# EAGLE design Keypad_06 (EAGLE 6.5.0)
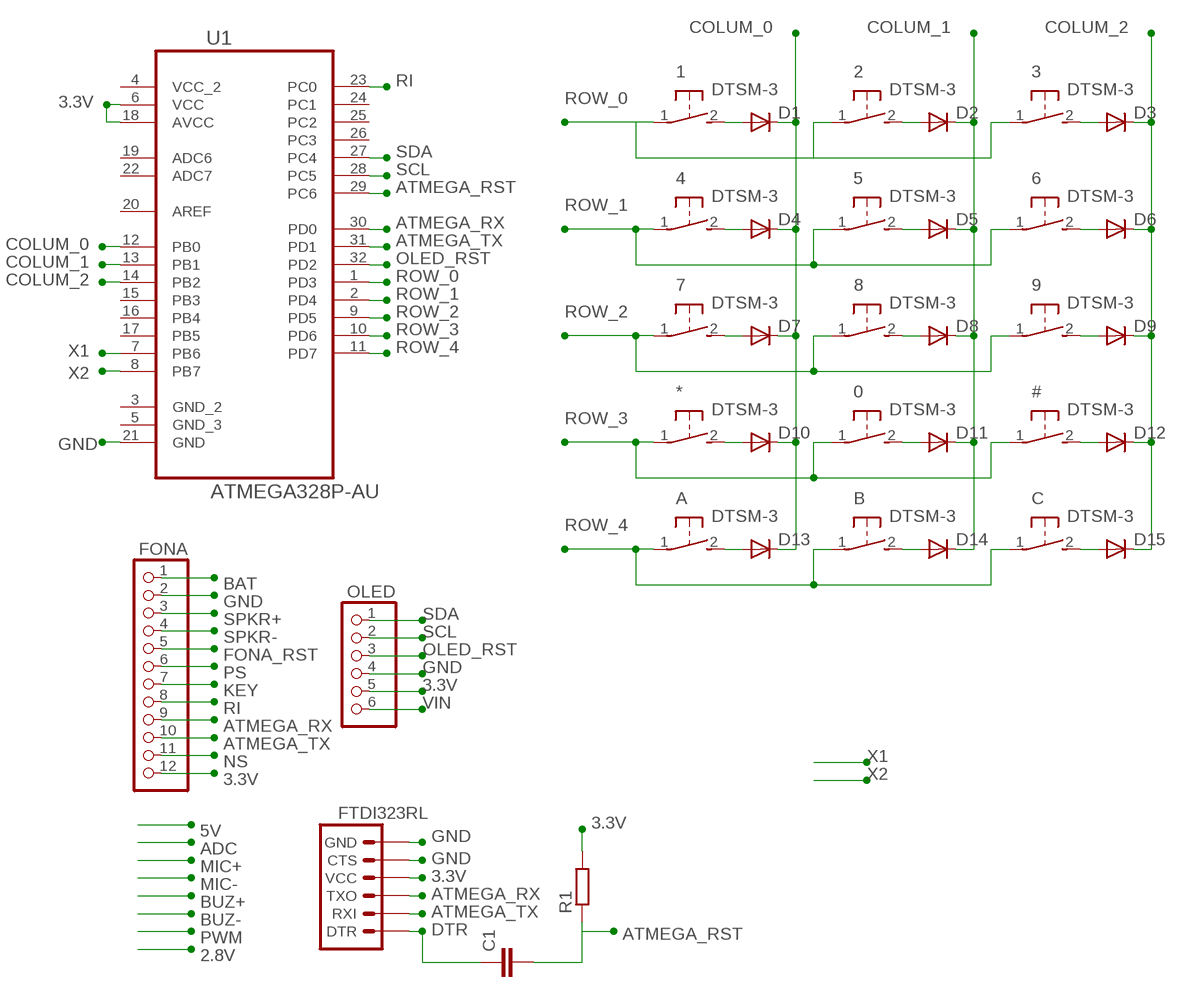
[diagram p0: schematic, sheet 1]

## Parts
0  DTSM-3  [DTSM-3]
1  DTSM-3  [DTSM-3]
2  DTSM-3  [DTSM-3]
3  DTSM-3  [DTSM-3]
4  DTSM-3  [DTSM-3]
5  DTSM-3  [DTSM-3]
6  DTSM-3  [DTSM-3]
7  DTSM-3  [DTSM-3]
8  DTSM-3  [DTSM-3]
9  DTSM-3  [DTSM-3]
#  DTSM-3  [DTSM-3]
*  DTSM-3  [DTSM-3]
A  DTSM-3  [DTSM-3]
B  DTSM-3  [DTSM-3]
C  DTSM-3  [DTSM-3]
C1  C-EUC0805  [C0805]
D1  DIODE-SOD123  [SOD123]
D2  DIODE-SOD123  [SOD123]
D3  DIODE-SOD123  [SOD123]
D4  DIODE-SOD123  [SOD123]
D5  DIODE-SOD123  [SOD123]
D6  DIODE-SOD123  [SOD123]
D7  DIODE-SOD123  [SOD123]
D8  DIODE-SOD123  [SOD123]
D9  DIODE-SOD123  [SOD123]
D10  DIODE-SOD123  [SOD123]
D11  DIODE-SOD123  [SOD123]
D12  DIODE-SOD123  [SOD123]
D13  DIODE-SOD123  [SOD123]
D14  DIODE-SOD123  [SOD123]
D15  DIODE-SOD123  [SOD123]
FONA  PINHD-1X12  [1X12]
FTDI323RL  ARDUINO_SERIAL_PROGRAMLOCK  [1X06_LOCK]
OLED  PINHD-1X6  [1X06]
R1  R-EU_M1206  [M1206]
U1  ATMEGA328P-AU  [QFP80P900X900X120-32N]

## Nets
1: #.2 D12.A
3: 3.2 D3.A
3.3V: FONA.12 FTDI323RL.4(VCC) OLED.5 R1.2 U1.6(VCC) U1.18(AVCC)
5: 5.2 D5.A
ATMEGA_RST: C1.2 R1.1 U1.29(PC6)
ATMEGA_RX: FONA.9 FTDI323RL.3(TXO) U1.30(PD0)
ATMEGA_TX: FONA.10 FTDI323RL.2(RXI) U1.31(PD1)
BAT: FONA.1
COLUM_0: D1.C D4.C D7.C D10.C D13.C U1.12(PB0)
COLUM_1: D2.C D5.C D8.C D11.C D14.C U1.13(PB1)
COLUM_2: D3.C D6.C D9.C D12.C D15.C U1.14(PB2)
DTR: C1.1 FTDI323RL.1(DTR)
FONA_RST: FONA.5
GND: FONA.2 FTDI323RL.5(CTS) FTDI323RL.6(GND) OLED.4 U1.21(GND)
KEY: FONA.7
N$6: 1.2 D1.A
N$7: 2.2 D2.A
N$14: 4.2 D4.A
N$16: 6.2 D6.A
N$19: 7.2 D7.A
N$20: 8.2 D8.A
N$21: 9.2 D9.A
N$24: *.2 D10.A
N$25: 0.2 D11.A
N$32: A.2 D13.A
N$33: B.2 D14.A
N$34: C.2 D15.A
NS: FONA.11
OLED_RST: OLED.3 U1.32(PD2)
PS: FONA.6
RI: FONA.8 U1.23(PC0)
ROW_0: 1.1 2.1 3.1 U1.1(PD3)
ROW_1: 4.1 5.1 6.1 U1.2(PD4)
ROW_2: 7.1 8.1 9.1 U1.9(PD5)
ROW_3: 0.1 #.1 *.1 U1.10(PD6)
ROW_4: A.1 B.1 C.1 U1.11(PD7)
SCL: OLED.2 U1.28(PC5)
SDA: OLED.1 U1.27(PC4)
SPKR+: FONA.3
SPKR-: FONA.4
VIN: OLED.6
X1: U1.7(PB6)
X2: U1.8(PB7)
Unconnected: U1.3(GND_2) U1.5(GND_3) U1.15(PB3) U1.16(PB4) U1.17(PB5) U1.19(ADC6) U1.20(AREF) U1.22(ADC7) U1.24(PC1) U1.25(PC2) U1.26(PC3)

## Power pins joined to a net without a drawn wire
VCC_2: U1.4(VCC_2)

## Library data of the parts
0 1-9 # * A B C = switch-tact:DTSM-3
C1 = rcl:C-EU: CAPACITOR, European symbol
D1-D15 = diode:DIODE-: DIODE
FONA = pinhead:PINHD-1X12: PIN HEADER
FTDI323RL = SparkFun-Connectors:ARDUINO_SERIAL_PROGRAM: FTDI connector footprints
OLED = pinhead:PINHD-1X6: PIN HEADER
R1 = resistor:R-EU_: RESISTOR, European symbol
U1 = atmelmega328pau:ATMEGA328P-AU: 8-bit Microcontroller with In-System Programmable Flash; MPN: ATMEGA328P-AU; OC_FARNELL: 1715486; OC_NEWARK: 68T2935; PACKAGE: TQFP-32; SUPPLIER: Atmel

## Board
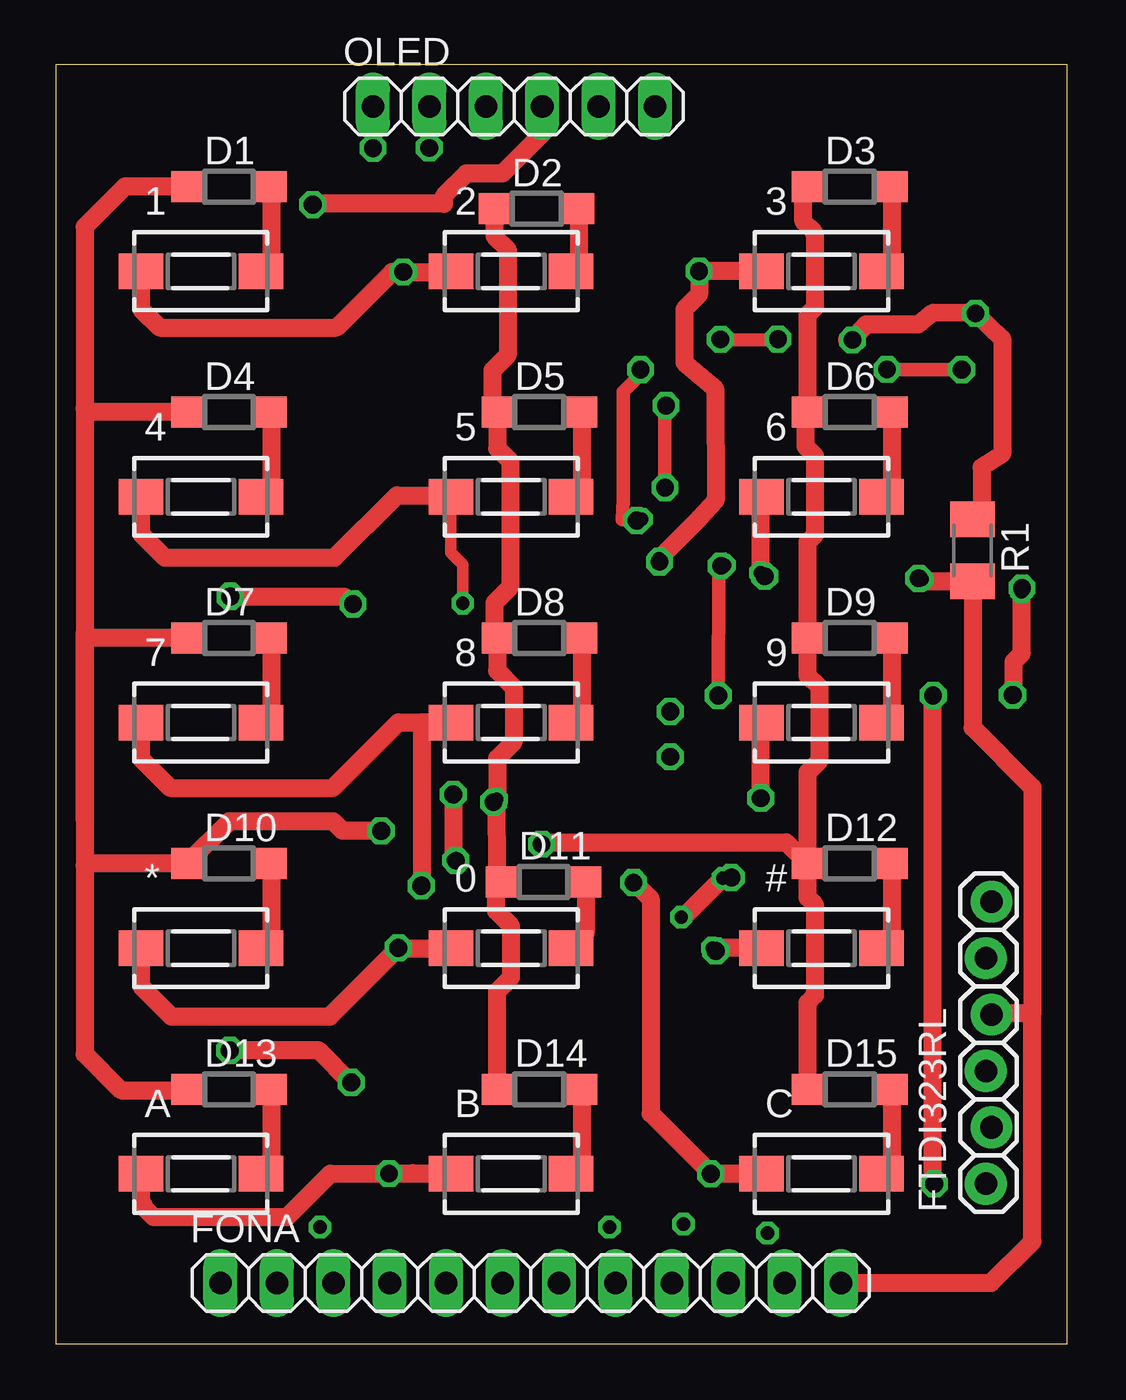
[diagram p1: board, top side]
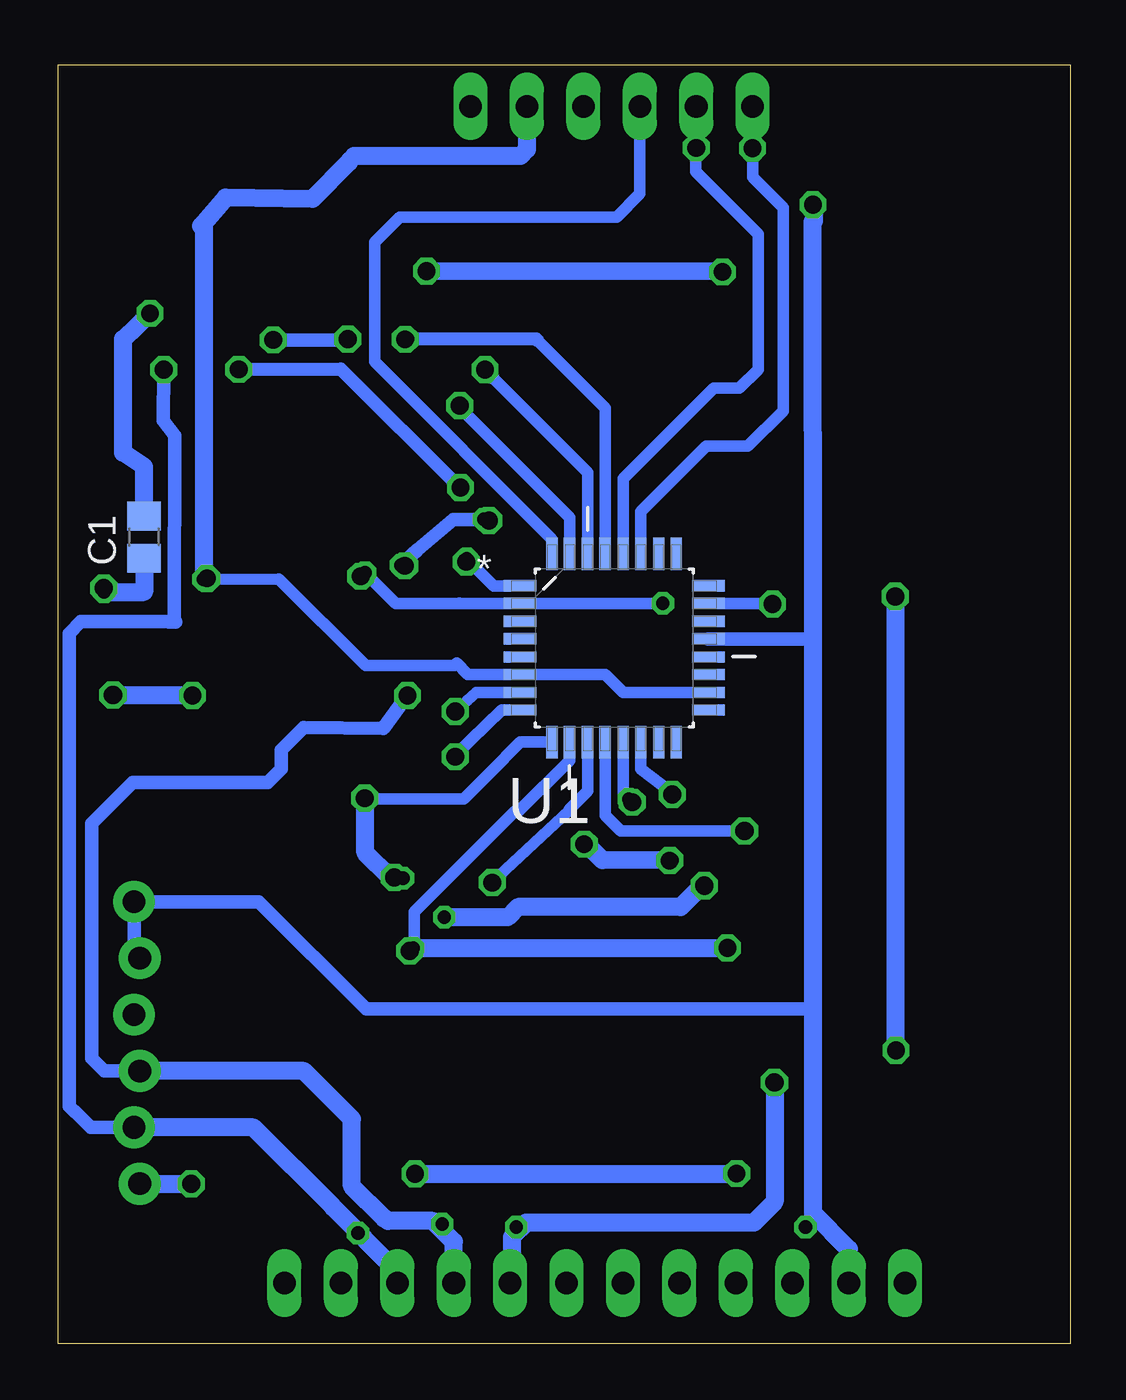
[diagram p2: board, bottom side, seen from below]

Size 45.54 x 57.62 mm. Coordinates in mm from the lower left corner, seen from the top.
Outline: 0,0 45.54,0 45.54,57.61 0,57.62 0,0
Copper layers (1*16): Top 0.035mm / dielectric 1.5mm / Bottom 0.035mm
Design rules "default": minimum track width 10mil, minimum drill 24mil, track to track 8mil, track to pad 8mil, pad to pad 8mil, via to via 8mil, smd to smd 8mil, copper to edge 40mil, drill to drill 8mil, minimum pad ring 10mil, minimum via ring 8mil, stop-mask expansion 4mil, vias tented up to drill 0mil, thermal gap 10mil

### Footprints (pad centres in the part's own frame; a part is rotated, then mirrored left to right if it is on the bottom)
DTSM-3 = smd 2 x 1.6: 1 -2.7,0; 2 2.7,0
C0805 = smd 1.3 x 1.5: 1 -0.95,0; 2 0.95,0
SOD123 = smd 1.4 x 1.4: A 1.9,0; C -1.9,0
1X12 = drill 1.016 long: 1 -13.97,0; 2 -11.43,0; 3 -8.89,0; 4 -6.35,0; 5 -3.81,0; 6 -1.27,0; 7 1.27,0; 8 3.81,0; 9 6.35,0; 10 8.89,0; 11 11.43,0; 12 13.97,0
1X06_LOCK = drill 1.016 pad 1.88: 1 0,0; 2 2.54,-0.254; 3 5.08,0; 4 7.62,-0.254; 5 10.16,0; 6 12.7,-0.254
1X06 = drill 1.016 long: 1 -6.35,0; 2 -3.81,0; 3 -1.27,0; 4 1.27,0; 5 3.81,0; 6 6.35,0
M1206 = smd 1.6 x 2: 1 -1.4,0; 2 1.4,0
QFP80P900X900X120-32N = smd 1.473 x 0.508: 1 -4.242,2.794; 2 -4.242,2.007; 3 -4.242,1.194; 4 -4.242,0.406; 5 -4.242,-0.406; 6 -4.242,-1.194; 7 -4.242,-2.007; 8 -4.242,-2.794; 17 4.242,-2.794; 18 4.242,-2.007; 19 4.242,-1.194; 20 4.242,-0.406; 21 4.242,0.406; 22 4.242,1.194; 23 4.242,2.007; 24 4.242,2.794 | smd 0.508 x 1.473: 9 -2.794,-4.242; 10 -2.007,-4.242; 11 -1.194,-4.242; 12 -0.406,-4.242; 13 0.406,-4.242; 14 1.194,-4.242; 15 2.007,-4.242; 16 2.794,-4.242; 25 2.794,4.242; 26 2.007,4.242; 27 1.194,4.242; 28 0.406,4.242; 29 -0.406,4.242; 30 -1.194,4.242; 31 -2.007,4.242; 32 -2.794,4.242

### Placement (x,y rotation side)
0  20.51,17.82 0 top
1  6.54,48.3 0 top
2  20.51,48.3 0 top
3  34.48,48.3 0 top
4  6.54,38.14 0 top
5  20.51,38.14 0 top
6  34.48,38.14 0 top
7  6.54,27.98 0 top
8  20.51,27.98 0 top
9  34.48,27.98 0 top
#  34.48,17.82 0 top
*  6.54,17.82 0 top
A  6.54,7.66 0 top
B  20.51,7.66 0 top
C  34.48,7.66 0 top
C1  41.68,36.33 90 bottom
D1  7.81,52.11 0 top
D2  21.65,51.12 0 top
D3  35.75,52.11 0 top
D4  7.81,41.95 0 top
D5  21.78,41.95 0 top
D6  35.75,41.95 0 top
D7  7.81,31.79 0 top
D8  21.78,31.79 0 top
D9  35.75,31.79 0 top
D10  7.81,21.63 0 top
D11  21.96,20.81 0 top
D12  35.75,21.63 0 top
D13  7.81,11.47 0 top
D14  21.78,11.47 0 top
D15  35.75,11.47 0 top
FONA  21.39,2.75 0 top
FTDI323RL  41.88,7.21 90 top
OLED  20.64,55.73 0 top
R1  41.28,35.74 270 top
U1  20.52,31.34 0 bottom

### Tracks (layer width: path | path; a pad name or v marks a point on that pad's centre or on a via)
1
  Top 0.813: D12.A 37.65,18.29 #.2
3
  Top 0.813: D3.A 37.65,48.77 3.2
3.3V  (via drill 0.6)
  Top 0.813: FONA.12 42.11,2.75 43.97,4.61 43.97,14.89 | 43.97,14.89 42.19,14.89 FTDI323RL.4 | 43.97,14.89 43.97,25.07 41.28,27.76 R1.2 39.21,34.34 v39.01,34.43
  Bottom 0.508: U1.18 20.12,29.34 20.92,30.14 24.75,30.14 U1.6 27.11,30.15 27.62,30.66 27.73,30.54 31.71,30.54 35.62,34.45 v39.01,34.43
  Bottom 0.61: 38.99,50.32 39.12,50.34
  Bottom 0.813: OLED.5 24.45,53.79 24.75,53.49 32.23,53.49 32.47,53.25 32.47,53.21 34.11,51.56 38.02,51.62 39.12,50.34 | 38.99,50.32 v39.01,34.43
5
  Top 0.813: D5.A 23.68,38.61 5.2
ATMEGA_RST  (via drill 0.6, 0.8)
  Top 0.61: v32.56,45.23 29.84,45.21 v29.82,45.26
  Top 0.813: R1.1 41.69,37.55 41.69,39.48 42.62,40.07 42.62,45.28 41.43,46.42 v41.38,46.43 41.4,46.42 39.5,46.43 38.82,45.91 36.49,45.9 36.45,45.88 v35.87,45.21 35.63,45.21 v35.87,45.21
  Bottom 0.508: U1.29 20.93,42.15 23.98,45.21
  Bottom 0.61: v35.87,45.21 32.57,45.21 v32.56,45.23 | v29.82,45.26 24.03,45.25 23.98,45.21
  Bottom 0.813: C1.2 41.68,39.5 42.62,40.13 42.62,45.25 v41.38,46.43
  other vias: 35.86,45.21
ATMEGA_RX  (via drill 0.6)
  Top 0.61: v29.83,29.2 29.86,34.69 v30.12,35.07 | v26.39,37.13 25.52,37.13 25.55,38 25.55,42.88 26.32,43.66 26.56,43.66 v26.34,43.87
  Bottom 0.508: U1.30 21.72,39.25 25.98,43.51
  Bottom 0.61: 34.49,12.29 43.47,12.29 44.04,12.85 44.04,23.44 42.2,25.28 36.11,25.28 35.5,25.88 35.5,26.75 34.49,27.76 30.92,27.72 v29.83,29.2 | v30.12,35.07 29.37,35.76 27.77,37.13 v26.39,37.13 | v26.34,43.87 25.98,43.51
  Bottom 0.813: FONA.9 27.74,4.6 28.68,5.54 30.71,5.54 30.82,5.66 30.88,5.66 32.33,7.11 32.33,10.13 34.49,12.29 FTDI323RL.3
ATMEGA_TX  (via drill 0.6, 0.8)
  Top 0.61: v40.79,43.88 37.57,43.87 v37.43,43.87 | v27.41,38.49 27.41,42.21 v27.48,42.25
  Bottom 0.508: U1.31 22.53,37.2 27.73,42.41 v27.48,42.25
  Bottom 0.61: 36.77,9.75 44.08,9.75 44.79,10.46 44.82,10.46 45.06,10.71 45.06,32 44.53,32.53 40.59,32.53 40.58,32.52 40.54,32.52 40.25,32.5 40.32,32.72 40.31,40.89 40.81,41.57 v40.79,43.88 | v37.43,43.87 32.83,43.89 v27.41,38.49
  Bottom 0.813: FONA.10 30.28,3.26 33.18,6.15 33.18,6.17 36.77,9.75 FTDI323RL.2
COLUM_0  (via drill 0.8)
  Top 0.813: D1.C 3.12,52.11 1.31,50.31 1.31,42.13 | 1.31,42.13 1.31,32.01 | 1.31,32.01 1.31,21.55 | 1.31,21.55 1.31,13.06 2.95,11.42 5.86,11.42 D13.C | 1.31,21.55 1.4,21.63 D10.C 7.82,23.54 12.49,23.54 12.92,23.11 v14.66,23.11 | 1.31,32.01 1.53,31.79 D7.C 1.37,31.79 1.29,31.87 1.29,23.63 | D4.C 1.49,41.95 1.31,42.13
  Bottom 0.508: 20.95,27.08 U1.12 20.92,23.79 20.24,23.11 v14.66,23.11
COLUM_1  (via drill 0.6)
  Top 0.813: D2.C 19.75,49.89 20.34,49.29 20.34,44.52 19.67,43.84 19.67,42.17 D5.C 19.88,40.34 20.47,39.75 20.47,34.09 19.75,33.38 19.75,31.93 D8.C 19.88,30.32 20.62,29.57 20.62,27.11 19.88,26.37 19.88,24.82 v19.86,24.54 19.88,21.26 20.07,21.08 D11.C 19.83,20.58 19.83,19.49 20.5,18.82 20.5,16.51 19.88,15.89 D14.C
  Bottom 0.508: v19.86,24.54 20.05,24.82 20.12,24.75 U1.13
COLUM_2  (via drill 0.6)
  Top 0.813: D15.C 33.85,15.37 34.2,15.71 34.2,19.76 33.86,20.1 33.86,21.63 D12.C | D12.C 33.85,25.73 34.39,26.28 34.39,29.55 33.86,30.09 33.86,31.79 D9.C 33.85,36.11 34.2,36.46 34.2,39.99 33.76,40.42 33.76,41.87 D6.C 33.85,46.34 34.2,46.68 34.2,49.97 34.15,50.02 34.15,50.06 33.67,50.55 33.67,51.93 D3.C | v17.91,24.8 v17.91,21.78 | v21.85,22.59 32.89,22.59 D12.C
  Bottom 0.508: U1.14 19.33,25.89 v17.91,24.8
  Bottom 0.813: v17.91,21.78 21.05,21.79 v21.85,22.59
DTR  (via drill 0.6, 0.8)
  Top 0.813: v39.48,7.21 v39.48,29.19 | v43.48,33.86 43.49,31.14 43.49,31.09 43.12,30.71 43.12,29.24 v43.1,29.22
  Bottom 0.813: C1.1 41.68,33.86 v43.48,33.86 | FTDI323RL.1 v39.55,7.21 v39.49,7.21 v39.48,7.21 | v39.48,29.19 43.06,29.19 v43.1,29.22
GND  (via drill 0.6)
  Top 0.813: OLED.4 21.93,55.71 21.93,54.51 20.12,52.7 18.48,52.7 17.48,51.71 17.48,51.34 v11.54,51.34
  Bottom 0.61: U1.21 12.74,31.75 12.74,31.74 11.66,31.74 11.57,31.65 | FTDI323RL.5 42.13,17.63 FTDI323RL.6 36.51,19.91 31.69,15.09 11.64,15.09 11.57,15.02
  Bottom 0.813: FONA.2 9.96,4.27 11.57,5.88 11.57,15.02 11.57,31.65 11.59,50.53 11.54,50.58 v11.54,51.34
N$1  (via drill 0.6)
  other vias: 11.91,5.26
N$2  (via drill 0.6)
  other vias: 24.93,5.26
N$3  (via drill 0.6)
  other vias: 14.29,53.86
N$4  (via drill 0.6)
  other vias: 16.83,53.91
N$5  (via drill 0.6)
  other vias: 28.26,5.4
N$6
  Top 0.813: D1.A 9.71,48.77 1.2
N$7
  Top 0.813: D2.A 23.55,48.65 2.2
N$8  (via drill 0.6)
  other vias: 32.05,5
N$9  (via drill 0.8)
  other vias: 27.67,26.44
N$10  (via drill 0.8)
  other vias: 27.67,28.49
N$11  (via drill 0.8)
  other vias: 14.29,53.85
N$12  (via drill 0.8)
  other vias: 16.83,53.86
N$13  (via drill 0.8)
  other vias: 11.58,51.31
N$14
  Top 0.813: D4.A 9.71,38.61 4.2
N$15  (via drill 0.8)
  other vias: 15.65,48.27
N$16
  Top 0.813: D6.A 37.65,38.61 6.2
N$17  (via drill 0.8)
  other vias: 28.97,48.31
N$18  (via drill 0.8)
  other vias: 26.33,43.87
N$19
  Top 0.813: D7.A 9.71,28.45 7.2
N$20
  Top 0.813: D8.A 23.68,28.45 8.2
N$21
  Top 0.813: D9.A 37.65,28.45 9.2
N$22  (via drill 0.8)
  other vias: 27.48,42.25
N$23  (via drill 0.8)
  other vias: 27.44,38.56
N$24
  Top 0.813: D10.A 9.71,18.29 *.2
N$25
  Top 0.813: D11.A 23.86,18.48 0.2
N$26  (via drill 0.8)
  other vias: 26.16,37.08
N$27  (via drill 0.8)
  other vias: 27.18,35.22
N$28  (via drill 0.8)
  other vias: 29.95,35.04
N$29  (via drill 0.8)
  other vias: 31.93,34.57
N$30  (via drill 0.8)
  other vias: 29.93,45.24
N$31  (via drill 0.8)
  other vias: 32.52,45.25
N$32
  Top 0.813: D13.A 9.71,8.13 A.2
N$33
  Top 0.813: D14.A 23.68,8.13 B.2
N$34
  Top 0.813: D15.A 37.65,8.13 C.2
N$35  (via drill 0.8)
  other vias: 37.43,43.88
N$36  (via drill 0.8)
  other vias: 40.79,43.88
N$37  (via drill 0.8)
  other vias: 41.41,46.41
N$38  (via drill 0.8)
  other vias: 13.39,33.32
N$39  (via drill 0.8)
  other vias: 14.65,23.1
N$40  (via drill 0.8)
  other vias: 16.47,20.65
N$41  (via drill 0.8)
  other vias: 18.03,21.77
N$42  (via drill 0.8)
  other vias: 17.91,24.75
N$43  (via drill 0.8)
  other vias: 21.88,22.5
N$44  (via drill 0.8)
  other vias: 26.02,20.78
N$46  (via drill 0.8)
  other vias: 30.42,21.01
N$47  (via drill 0.8)
  other vias: 15.42,17.83
N$48  (via drill 0.8)
  other vias: 7.84,13.22
N$49  (via drill 0.8)
  other vias: 13.32,11.79
N$50  (via drill 0.8)
  other vias: 15.01,7.68
N$51  (via drill 0.8)
  other vias: 7.87,33.67
N$52  (via drill 0.8)
  other vias: 29.49,7.66
N$53  (via drill 0.8)
  other vias: 29.72,17.7
N$54  (via drill 0.8)
  other vias: 31.76,24.58
N$55  (via drill 0.8)
  other vias: 29.83,29.2
N$56  (via drill 0.8)
  other vias: 38.86,34.47
N$57  (via drill 0.8)
  other vias: 43.5,34.04
N$58  (via drill 0.8)
  other vias: 43.07,29.22
N$59  (via drill 0.8)
  other vias: 39.5,29.2
N$60  (via drill 0.8)
  other vias: 19.71,24.4
OLED_RST
  Bottom 0.508: OLED.3 19.37,51.79 20.41,50.74 30.18,50.74 31.3,49.62 31.3,44.23 23.32,36.25 U1.32
RI  (via drill 0.6, 0.8)
  Top 0.813: v13.4,33.31 13.34,33.31 13,33.64 v7.87,33.64 | v7.84,13.24 11.82,13.24 v13.3,11.77
  Bottom 0.508: U1.23 13.44,33.35 v13.4,33.31
  Bottom 0.813: v7.87,33.64 7.87,13.27 v7.84,13.24 | v13.3,11.77 13.3,6.41 14.24,5.47 24.49,5.47 25.13,4.83 25.13,2.83 FONA.8
ROW_0  (via drill 0.6)
  Top 0.813: 1.1 3.84,46.61 4.68,45.77 12.66,45.77 15.15,48.27 v15.65,48.27 17.77,48.27 2.1 | 3.1 v28.98,48.31 28.98,47.27 28.3,46.6 28.31,44.2 29.69,43.01 29.72,37.99 28.98,37.17 v27.16,35.36
  Bottom 0.508: U1.1 25.94,34.14 v27.16,35.36
  Bottom 0.813: v28.98,48.31 15.7,48.32 v15.65,48.27
ROW_1  (via drill 0.6)
  Top 0.508: v18.33,33.35 18.33,35.11 17.79,35.64 17.79,38.13 5.1
  Top 0.813: 4.1 3.84,36.49 4.92,35.41 12.55,35.41 15.36,38.21 17.74,38.21 5.1 | v31.74,34.72 31.74,37.47 31.25,37.95 31.59,37.95 6.1
  Bottom 0.508: U1.2 27.5,33.35 27.5,33.36 | U1.2 30.37,33.35 v31.74,34.72 | U1.2 v18.33,33.35
ROW_2  (via drill 0.6, 0.8)
  Top 0.813: 7.1 3.84,26.37 5.16,25.04 12.48,25.04 15.43,27.99 8.1 16.5,27.98 16.48,28 16.48,20.66 v16.46,20.63 | v31.74,24.57 31.74,27.95 9.1 | v28.17,19.21 28.29,19.23 v30.04,20.98
  Bottom 0.508: U1.9 24.75,27.1 26.12,25.72 26.13,25.72 27.3,24.55 31.72,24.55
  Bottom 0.813: v16.46,20.63 16.58,20.63 17.53,19.68 24.85,19.68 25.32,19.21 27.9,19.21 v28.17,19.21 | v30.04,20.98 30.6,21 31.72,22.12 31.72,24.55 v31.74,24.57
ROW_3  (via drill 0.6)
  Top 0.813: *.1 3.84,16.13 5.22,14.75 12.35,14.75 v15.41,17.81 17.8,17.81 0.1 | #.1 v29.57,17.82 v29.57,17.83
  Bottom 0.508: U1.10 22.53,26.28 24.81,24 24.97,24 29.52,19.45 29.52,17.88 v29.57,17.83
  Bottom 0.813: v29.57,17.83 15.43,17.83 v15.41,17.81
ROW_4  (via drill 0.6)
  Top 0.508: 3.84,6.28 3.96,6.28
  Top 0.813: 16.1,7.68 15.22,7.68 15.21,7.69 v14.99,7.69 | 16.1,7.68 17.8,7.68 B.1 | A.1 3.84,6.28 | v14.99,7.69 12.38,7.67 10.43,5.72 4.41,5.72 3.96,6.17 3.96,6.28 | C.1 29.53,7.66 v29.52,7.65 26.79,10.38 26.79,20.05 26.05,20.79 v26.02,20.79 | v14.99,7.69 16.09,7.69 16.1,7.68
  Bottom 0.508: U1.11 21.72,24.9 22.54,24.07 22.54,24.02 v26.02,20.79
  Bottom 0.813: v29.52,7.65 15.03,7.65 v14.99,7.69
SCL
  Bottom 0.508: U1.28 20.12,38.97 16.05,43.04 14.88,43.04 14.04,43.88 14.04,49.97 16.85,52.79 16.85,55.71 OLED.2
SDA
  Bottom 0.508: U1.27 19.33,37.48 16.38,40.43 14.5,40.43 12.92,42.01 12.92,51.17 14.29,52.54 OLED.1
X1
  Bottom 0.508: U1.7 26.74,29.34 27.15,28.97
X2
  Bottom 0.508: U1.8 25.59,28.55 27.7,26.49